# Altium schematic sheet Sensors.SchDoc: Sensors
size A4; DrawnBy: Samyar Sadat Akhavi; Revision: 1.0; SheetNumber: 5; SheetTotal: 5
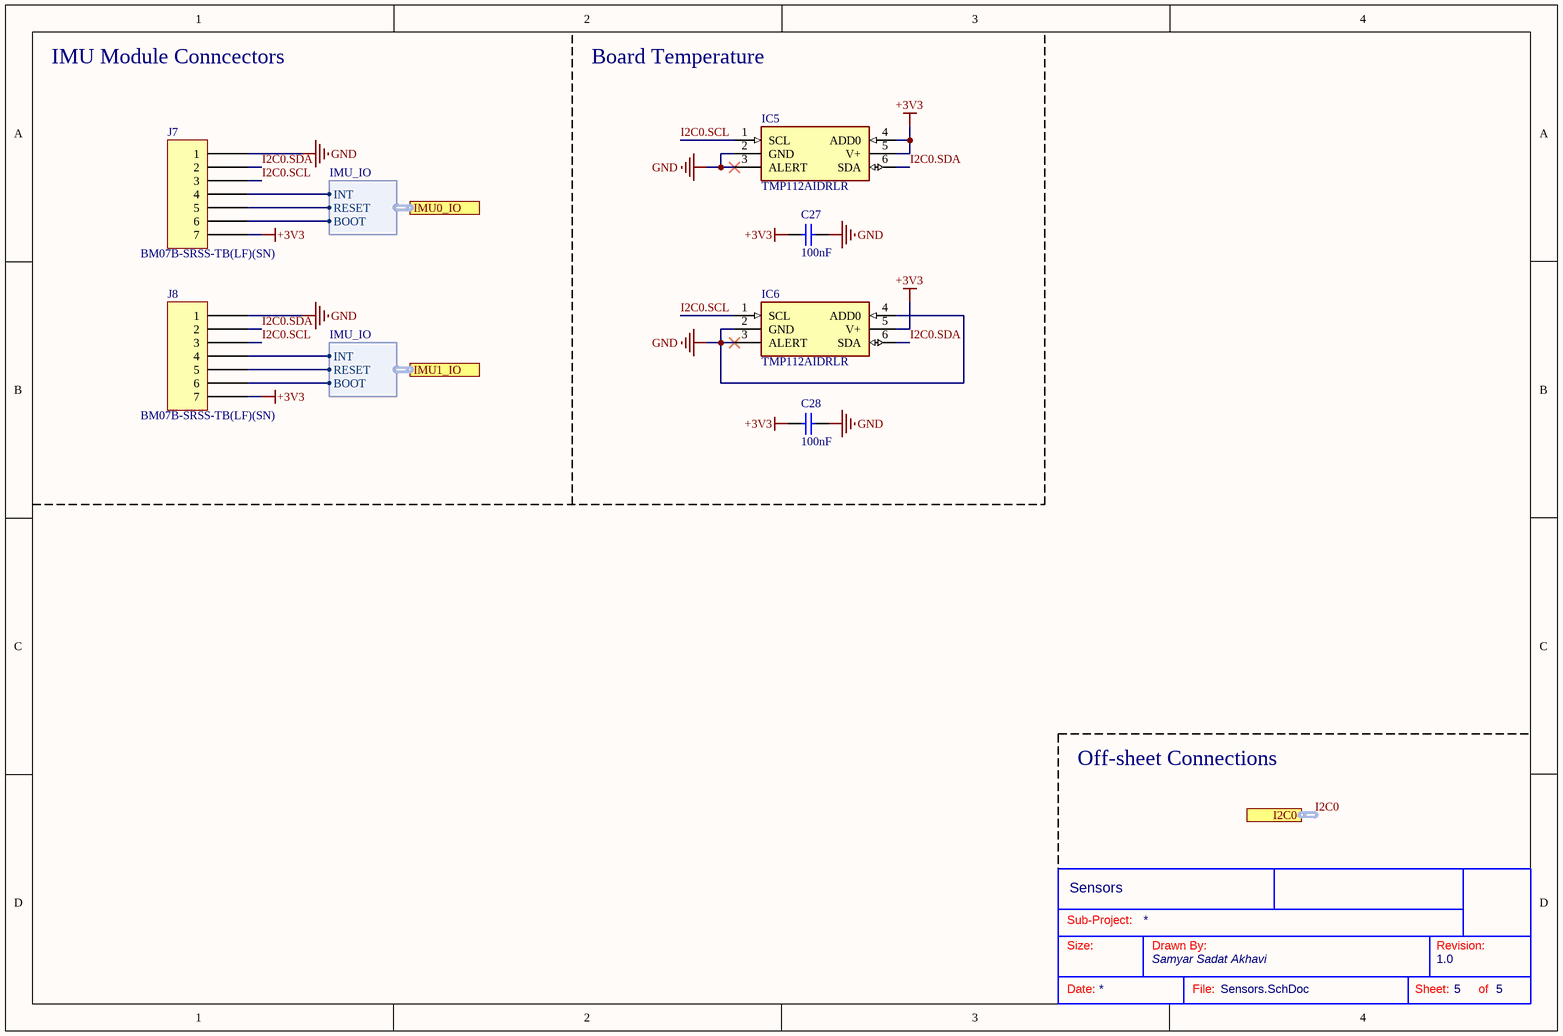
[diagram p0: Sensors.SchDoc]

## Parts
?  (no value)  (graphical)
C27  100nF  [CAP_SMD_603]
C28  100nF  [CAP_SMD_603]
IC5  TMP112AIDRLR  [SOTFL50P160X60-6N]
IC6  TMP112AIDRLR  [SOTFL50P160X60-6N]
J7  BM07B-SRSS-TB(LF)(SN)  [JST BM07B-SRSS-TB]
J8  BM07B-SRSS-TB(LF)(SN)  [JST BM07B-SRSS-TB]

## Ports
I2C0 (harness I2C, see Motor_Control_Board[2B], Microcontroller[4C]), IMU0_IO (harness IMU_IO, see Motor_Control_Board[2B], Microcontroller[1B]), IMU1_IO (harness IMU_IO, see Motor_Control_Board[2B], Microcontroller[1B])

## Harnesses
IMU_IO: INT, RESET, BOOT

## Nets
+3V3: C27.2 C28.2 IC5.4(ADD0) IC5.5(V+) IC6.5(V+) J7.7 J8.7
GND: C27.1 C28.1 IC5.2(GND) IC5.3(ALERT) IC6.2(GND) IC6.3(ALERT) IC6.4(ADD0) J7.1 J8.1
I2C0.SCL: IC5.1(SCL) IC6.1(SCL) J7.3 J8.3
I2C0.SDA: IC5.6(SDA) IC6.6(SDA) J7.2 J8.2
NetJ7_4: J7.4 ; port IMU0_IO.INT
NetJ7_5: J7.5 ; port IMU0_IO.RESET
NetJ7_6: J7.6 ; port IMU0_IO.BOOT
NetJ8_4: J8.4 ; port IMU1_IO.INT
NetJ8_5: J8.5 ; port IMU1_IO.RESET
NetJ8_6: J8.6 ; port IMU1_IO.BOOT

## Buses and harness runs
harness I2C0 = port I2C0

## Notes on the sheet
- IMU Module Conncectors
- Board Temperature
- Off-sheet Connections
- Sub-Project:
- Size:
- Drawn By:
- Revision:
- Date:
- File:
- Sheet:
- of

## Library data of the parts
? = Standard Title Block
C27 C28 = Non-polar Capacitor: Generic Ceramic Capacitor; Voltage: 6.3V; Value: 100nF
IC5 IC6 = TMP112AIDRLR: Integrated Circuit; Manufacturer_Name: Texas Instruments; Datasheet Link: http://www.ti.com/general/docs/suppproductinfo.tsp?distId=10&gotoUrl=http%3A%2F%2Fwww.ti.com%2Flit%2Fgpn%2Ftmp112; Height: 0.6mm; Manufacturer_Part_Number: TMP112AIDRLR; Mouser Part Number: 595-TMP112AIDRLR; Mouser Price/Stock: https://www.mouser.co.uk/ProductDetail/Texas-Instruments/TMP112AIDRLR?qs=62Z1lCHpKYghtK4%2FJn2ysA%3D%3D; Arrow Part Number: TMP112AIDRLR; Arrow Price/Stock: https://www.arrow.com/en/products/tmp112aidrlr/texas-instruments?utm_currency=USD&region=nac
J7 J8 = BM07B-SRSS-TB(LF)(SN): CONN HEADER SMD 7POS 1MM; Manufacturer: JST Sales America Inc.; Current Rating (Amps): 0.7A; Material Flammability Rating: UL94 V-0; Number of Positions: 7; Number of Positions Loaded: All; Pitch - Mating: 0.039" (1.00mm); Shrouding: Shrouded - 4 Wall; Style: Board to Cable/Wire; Voltage Rating: 50V; Part Number: BM07B-SRSS-TB(LF)(SN); ComponentLink1Description: Datasheet; ComponentLink1URL: http://www.jst-mfg.com/product/pdf/eng/eSH.pdf; ComponentLink2Description: DigiKey Link; ComponentLink2URL: http://digikey.com/product-detail/en/jst-sales-america-inc/BM07B-SRSS-TB-LF-SN/455-1793-1-ND/926864; Connector Type: Header; Contact Finish - Mating: Tin; Contact Finish - Post: Tin; Contact Material: Copper Alloy; Contact Shape: Square; Contact Type: Male Pin; Fastening Type: Push-Pull; Features: Solder Retention; Insulation Color: Natural; Insulation Height: 0.167" (4.25mm); Insulation Material: Polyamide (PA), Nylon; LastUpdated: 1/12/2020 10:15:04 PM; Lifecycle Status: Active; Minimum Order: 1; Mounting Type: Surface Mount; Number of Rows: 1; Operating Temperature: -25°C ~ 85°C; Packaging: TapeAndReel; PartId: 22; Part Status: Active; Price: 0.42; Series: SR; Supplier 1: DigiKey; Supplier Part Number 1: 455-1793-1-ND; Termination: Solder